# Altium schematic sheet BMS.SchDoc
size A4
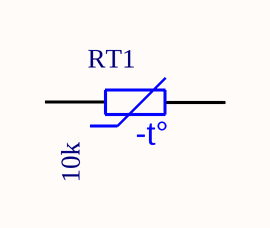
[diagram p0: BMS.SchDoc]

## Parts
RT1  Resistance in Ohms @ 25°C: 10k  [RES, 0603]  (hidden comment: NTC THERMISTORS 10K 0603 SMD)

## Nets

Not connected (* = marked no-connect by the designer): RT1 1 2

## Notes on the sheet
- (in symbol NTC THERMISTORS 10K 0603 SMD) -t°

## Library data of the parts
RT1 = NTC THERMISTORS 10K 0603 SMD: NTC THERMISTORS 10KOHM 1608 SMD; Manufacturer: Murata Electronics North America; Manufacturer Part Number: NCU18XH103F60RB; Resistance Tolerance: ±1%; B25/50: 3380K; B25/85: 3434K; B25/100: 3455K; Supplier 1: Digi-Key; RoHS: Request Inventory Verification; Category: Sensors, Transducers; Stock 1: 0; Pricing 1: 4000=0.06771, 8000=0.05974, 12000=0.05775, 20000=0.05675, 28000=0.05576 (CAD); Packaging: Tape & Reel (TR); Part Status: Active; B Value Tolerance: ±1%; B0/50: -; B25/75: -; Operating Temperature: -40°C ~ 125°C; Length - Lead Wire: -; Mounting Type: Surface Mount; Package / Case: 0603 (1608 Metric); ComponentLink1URL: https://www.murata.com/~/media/webrenewal/support/library/catalog/products/thermistor/r03e.ashx; ComponentLink1Description: https://www.murata.com/~/media/webrenewal/support/library/catalog/products/thermistor/r03e.ashx; Supplier Part Number 1: 490-16279-2-ND